# Altium schematic sheet BrauV2_RS485.SchDoc
size 420 x 297 mm; PageSetup: Record=PageOptions|CenterHorizontal=True|CenterVertical=True|PrintScale=1.01|XCorrection=1.00|YCorrection=1.00|PrintKind=1|BorderSize=5000000|LeftOffset=0|BottomOffset=0|Orientation=2|PaperLength=1000|PaperWidth=1000|Scale=100|PaperSource=7|PrintQuality=-4|MediaType=1|DitherType=10|PaperKind=A3|PrintScaleMode=1; DocumentNumber: 21; SheetNumber: 21; SheetTotal: 22
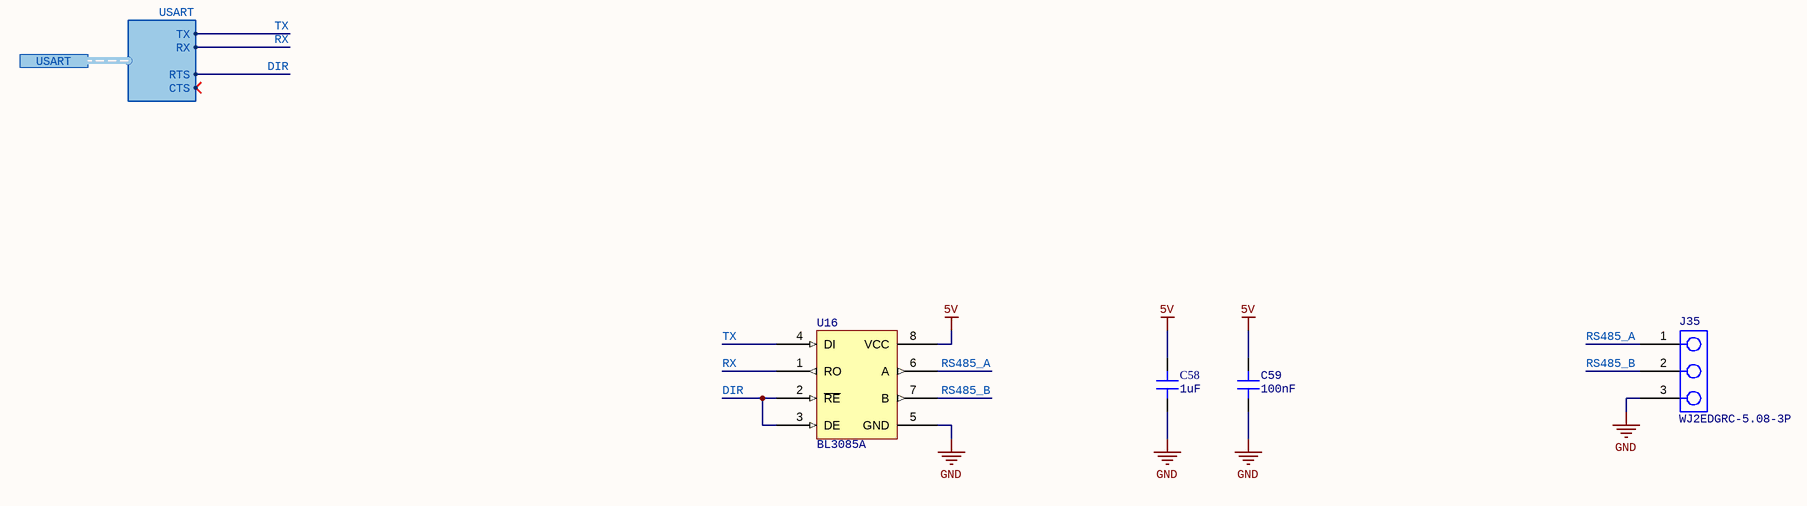
[diagram p0: BrauV2_RS485.SchDoc]

## Parts
C58  Capacitance: 1uF  [SMD_CAP_0603(0201)_N]  (hidden comment: CC0603KRX5R9BB105)
C59  Capacitance: 100nF  [SMD_CAP_0402(1005)_N]  (hidden comment: CC0402KRX5R6BB104)
J35  WJ2EDGRC-5.08-3P  [796638-3]
U16  BL3085A  [SOIC-8-3.9mm]

## Ports
USART (harness USART)

## Harnesses
USART: TX, RX, RTS, CTS

## Nets
5V: C58.2 C59.2 U16.8(VCC)
GND: C58.1 C59.1 J35.3 U16.5(GND)
DIR: U16.2(~{RE}) U16.3(DE) ; port USART.RTS
RS485_A: J35.1 U16.6(A)
RS485_B: J35.2 U16.7(B)
RX: U16.1(RO) ; port USART.RX
TX: U16.4(DI) ; port USART.TX

## Notes on the sheet
- FILE NAME
- PROJECT
- TITLE
- REV
- AUTHOR
- SIZE
- SHEET
- DATE
- OF
- A3

## Library data of the parts
C58 = 1uF 0603 50V 10%: 1uF ±10% 50V X5R 0603 Multilayer Ceramic Capacitors MLCC - SMD/SMT RoHS; Package: 0603; Tolerance: 10%; Voltage Rating: 50V
C59 = 100nF 0402 10V 10%: 100nF ±10% 10V X5R 0402 Multilayer Ceramic Capacitors MLCC - SMD/SMT RoHS; Package: 0402; Tolerance: 10%; Voltage Rating: 10V
J35 = WJ2EDGRC-5.08-3P: Covered（4Sided） 3 1 0.200"（5.08mm） 3 P=5.08mm Pluggable System Terminal Block RoHS
U16 = BL3085A: SOIC-8_150mil RS-485/RS-422 ICs ROHS (MAX485 clone)